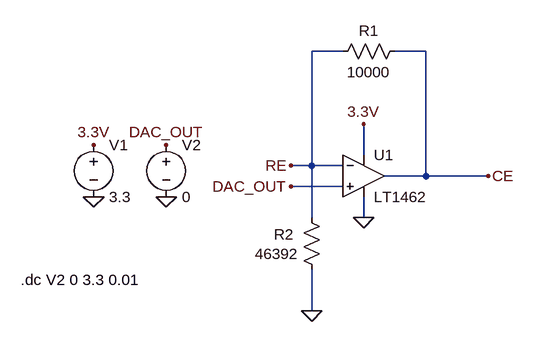
[diagram p0: schematic Control Amp LT1462 (Experimental).asc]
Control Amp LT1462 (Experimental).asc, the LTspice schematic file:
Version 4
SHEET 1 880 680
WIRE 144 -80 96 -80
WIRE 272 -80 224 -80
WIRE 176 80 176 32
WIRE 96 96 96 -80
WIRE 96 96 64 96
WIRE 144 96 96 96
WIRE 272 112 272 -80
WIRE 272 112 208 112
WIRE 368 112 272 112
WIRE 144 128 64 128
WIRE 96 176 96 96
WIRE 176 176 176 144
WIRE 96 320 96 256
FLAG -240 144 0
FLAG -240 64 3.3V
FLAG 64 96 RE
FLAG 176 176 0
FLAG 176 32 3.3V
FLAG 368 112 CE
FLAG 64 128 DAC_OUT
FLAG -128 64 DAC_OUT
FLAG -128 144 0
FLAG 96 320 0
SYMBOL OpAmps\\LT1462 176 48 R0
SYMATTR InstName U1
SYMBOL voltage -240 48 R0
WINDOW 123 0 0 Left 0
WINDOW 39 0 0 Left 0
SYMATTR InstName V1
SYMATTR Value 3.3
SYMBOL voltage -128 48 R0
WINDOW 123 0 0 Left 0
WINDOW 39 0 0 Left 0
SYMATTR InstName V2
SYMATTR Value 0
SYMBOL res 240 -96 R90
WINDOW 0 0 56 VBottom 2
WINDOW 3 32 56 VTop 2
SYMATTR InstName R1
SYMATTR Value 10000
SYMBOL res 112 272 R180
WINDOW 0 43 70 Left 2
WINDOW 3 36 40 Left 2
SYMATTR InstName R2
SYMATTR Value 46392
TEXT -352 272 Left 2 !.dc V2 0 3.3 0.01

The netlist it stands for:
* Control Amp LT1462 (Experimental).asc
XU1 DAC_OUT RE 3.3V 0 CE LT1462  ; pins In+ In- V+ V- OUT
V1 3.3V 0 3.3
V2 DAC_OUT 0 0
R1 CE RE 10000
R2 0 RE 46392
.dc V2 0 3.3 0.01
.lib LTC.lib
.backanno
.end

* Results of the author's LTspice run, read from the files saved beside the schematic
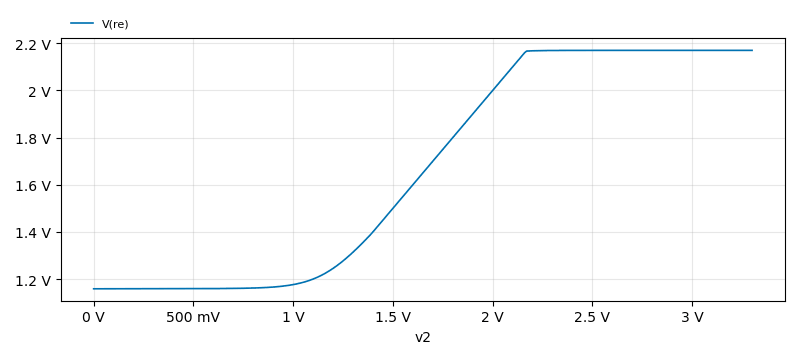
[diagram p1: DC transfer characteristic of Control Amp LT1462 (Experimental).asc, plotted from the saved traces]
* DC transfer characteristic, 1 run:
*   V(re): 1.159 V at v2=0 V, 2.17 V at v2=3.3 V, min 1.159 V, max 2.17 V